# Altium schematic sheet Sheet1.SchDoc: Schematic
size A4; SheetNumber: 1; SheetTotal: 1
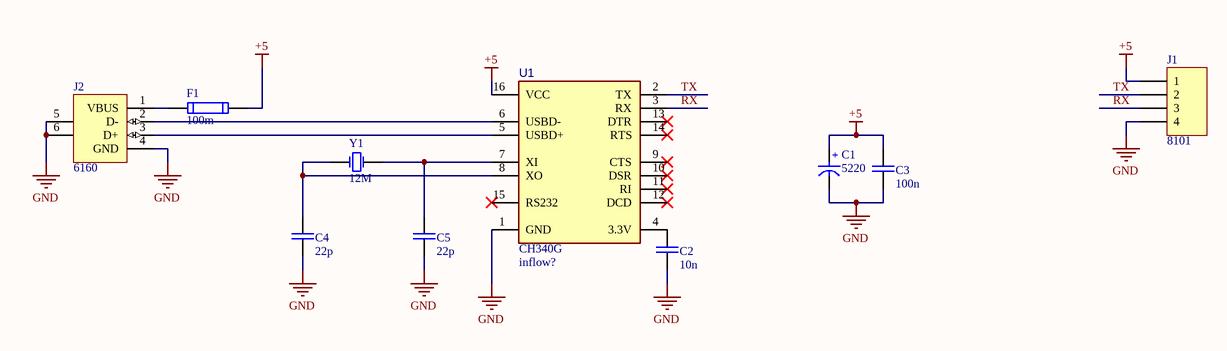
[diagram p0: Sheet1.SchDoc]

## Parts
C1  Inflow: 5220  [CAP ALUM 5MM]  (hidden comment: 10u)
C2  10n  [CAP 1206/3216]
C3  100n  [CAP 1206/3216]
C4  22p  [CAP 1206/3216]
C5  22p  [CAP 1206/3216]
F1  100m  [1206_F]
J1  Inflow: 8101  [HDR_THT_4F_2.54mm]  (hidden comment: 4)
J2  Inflow: 6160  [USB A TYPE Right Angle]  (hidden comment: Type A)
U1  Inflow: inflow?  [SO16_M]  (hidden comment: CH340G)
Y1  12M  [Crystal SMD]

## Nets
+5: C1.1(+) C3.1 F1.2 J1.1 U1.16(VCC)
GND: C1.2(-) C2.2 C3.2 C4.2 C5.2 J1.4 J2.4(GND) J2.5(MH) J2.6(MH) U1.1(GND)
RX: J1.3 U1.3(RX)
TX: J1.2 U1.2(TX)
NetC2_1: C2.1 U1.4(3.3V)
NetC4_1: C4.1 U1.8(XO) Y1.1(OSC1)
NetC5_1: C5.1 U1.7(XI) Y1.2(OSC2)
NetF1_1: F1.1 J2.1(VBUS)
NetJ2_2: J2.2(D-) U1.6(USBD-)
NetJ2_3: J2.3(D+) U1.5(USBD+)

Not connected (* = marked no-connect by the designer): U1 9(CTS)* 10(DSR)* 11(RI)* 12(DCD)* 13(DTR)* 14(RTS)* 15(RS232)*

## Notes on the sheet
- Title:
- Project:
- Drawn by:
- Revision:
- Hossein Bagheri
- Company:
- Sheet
- of

## Library data of the parts
C1 = Cap_Elec_10u_25_SMD: Electrolit Capacitor SMD; Rating: 6.3V; Validation: Valid; Value: 10u; Package: Package?; Type: Electrolit
C2 C4 C5 = Cap_Multi_SMD_1206: Bipolar ceramic capacitor SMD; Inflow: inflow?; Type: MultiLayer; Rating: Rating?; Validation: Valid; Package: 1206
  C2: Value: 10n
  C4 C5: Value: 22p
C3 = Cap_Multi_SMD_100nF_1206: Bipolar ceramic capacitor SMD; Type: MultiLayer; Inflow: inflow?; Rating: 50V; Validation: Valid; Package: 1206; Value: 100n
F1 = Other_Elec_Fuse_SMD: Short circiut  protection; Inflow: inflow?; Type: Fast; Rating: Rating?; Validation: Valid; Package: 1206; Value: 100m
J1 = Con_FPH_4x1_V_THT_2.54: Header, single row, 4 pin; Rating: Rating?; Validation: NT; Value: 4; Package: Package?; Type: Type?
J2 = Con_USB2_A: USB Connector-A Type; Rating: Rating?; Validation: NT; Value: Type A; Package: Package?; Type: Type?
U1 = IC_Converter_CH340G: TTL To USB Chip; Rating: Rating?; Validation: Valid; Type: USB to TTL; Package: SO-16; Value: CH340G
Y1 = Other_Elec_Xtal_SMD: Crystal Oscillator; Rating: Rating?; Inflow: inflow?; Validation: Valid; Package: SMD; Type: Quartz; Value: 12M